# EAGLE design n64-rgb-dac (EAGLE 7.2.0)
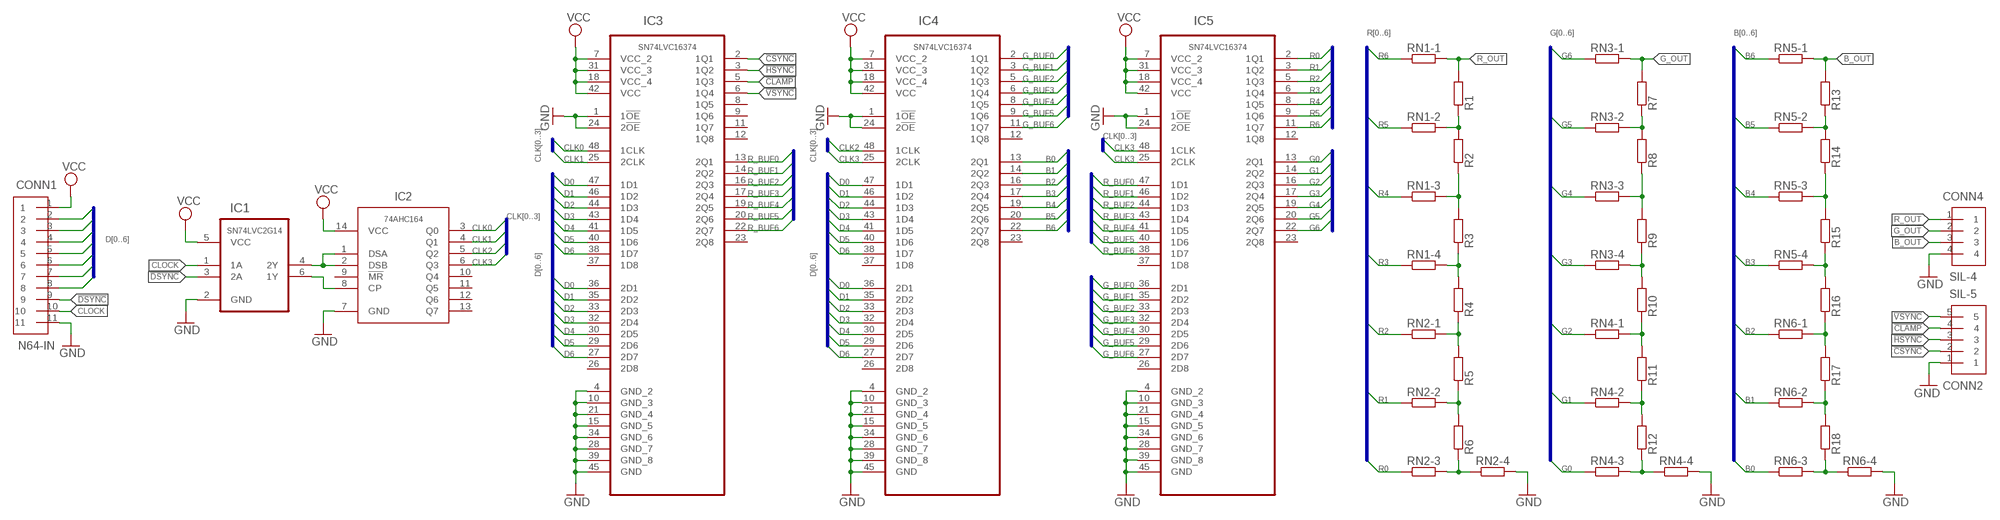
[diagram p0: schematic, sheet 1]

## Parts
CONN1  N64-IN  SIL-11  [SIL-SMD-11]
CONN2  SIL-5  [SIL-SMD-5]
CONN4  SIL-4  [SIL-SMD-4]
IC1  SN74LVC2G14  SN74LVC2G14IDCKRQ1  [SOT65P210X110-6N]
IC2  74AHC164PW  [SOT402-1]
IC3  SN74LVC16374DL  [SOP63P1035X279-48N]
IC4  SN74LVC16374DL  [SOP63P1035X279-48N]
IC5  SN74LVC16374DL  [SOP63P1035X279-48N]
R1  R-EU_R0603  [R0603]
R2  R-EU_R0603  [R0603]
R3  R-EU_R0603  [R0603]
R4  R-EU_R0603  [R0603]
R5  R-EU_R0603  [R0603]
R6  R-EU_R0603  [R0603]
R7  R-EU_R0603  [R0603]
R8  R-EU_R0603  [R0603]
R9  R-EU_R0603  [R0603]
R10  R-EU_R0603  [R0603]
R11  R-EU_R0603  [R0603]
R12  R-EU_R0603  [R0603]
R13  R-EU_R0603  [R0603]
R14  R-EU_R0603  [R0603]
R15  R-EU_R0603  [R0603]
R16  R-EU_R0603  [R0603]
R17  R-EU_R0603  [R0603]
R18  R-EU_R0603  [R0603]
RN1  TC164  [R0603_NET_4]
RN2  TC164  [R0603_NET_4]
RN3  TC164  [R0603_NET_4]
RN4  TC164  [R0603_NET_4]
RN5  TC164  [R0603_NET_4]
RN6  TC164  [R0603_NET_4]

## Nets
!CLAMP: CONN2.4 IC3.5(1Q3)
!CSYNC: CONN2.2 IC3.2(1Q1)
!DSYNC: CONN1.9 IC1.3(2A)
!HSYNC: CONN2.3 IC3.3(1Q2)
!VSYNC: CONN2.5 IC3.6(1Q4)
B0: IC4.13(2Q1) RN6.5
B1: IC4.14(2Q2) RN6.3
B2: IC4.16(2Q3) RN6.1
B3: IC4.17(2Q4) RN5.7
B4: IC4.19(2Q5) RN5.5
B5: IC4.20(2Q6) RN5.3
B6: IC4.22(2Q7) RN5.1
B_OUT: CONN4.3 R13.2 RN5.2
CLK0: IC2.3(Q0) IC3.48(1CLK)
CLK1: IC2.4(Q1) IC3.25(2CLK)
CLK2: IC2.5(Q2) IC4.48(1CLK)
CLK3: IC2.6(Q3) IC4.25(2CLK) IC5.25(2CLK) IC5.48(1CLK)
CLOCK: CONN1.10 IC1.1(1A)
D0: CONN1.2 IC3.36(2D1) IC3.47(1D1) IC4.36(2D1) IC4.47(1D1)
D1: CONN1.3 IC3.35(2D2) IC3.46(1D2) IC4.35(2D2) IC4.46(1D2)
D2: CONN1.4 IC3.33(2D3) IC3.44(1D3) IC4.33(2D3) IC4.44(1D3)
D3: CONN1.5 IC3.32(2D4) IC3.43(1D4) IC4.32(2D4) IC4.43(1D4)
D4: CONN1.6 IC3.30(2D5) IC3.41(1D5) IC4.30(2D5) IC4.41(1D5)
D5: CONN1.7 IC3.29(2D6) IC3.40(1D6) IC4.29(2D6) IC4.40(1D6)
D6: CONN1.8 IC3.27(2D7) IC3.38(1D7) IC4.27(2D7) IC4.38(1D7)
G0: IC5.13(2Q1) RN4.5
G1: IC5.14(2Q2) RN4.3
G2: IC5.16(2Q3) RN4.1
G3: IC5.17(2Q4) RN3.7
G4: IC5.19(2Q5) RN3.5
G5: IC5.20(2Q6) RN3.3
G6: IC5.22(2Q7) RN3.1
G_BUF0: IC4.2(1Q1) IC5.36(2D1)
G_BUF1: IC4.3(1Q2) IC5.35(2D2)
G_BUF2: IC4.5(1Q3) IC5.33(2D3)
G_BUF3: IC4.6(1Q4) IC5.32(2D4)
G_BUF4: IC4.8(1Q5) IC5.30(2D5)
G_BUF5: IC4.9(1Q6) IC5.29(2D6)
G_BUF6: IC4.11(1Q7) IC5.27(2D7)
G_OUT: CONN4.2 R7.2 RN3.2
GND: CONN1.11 CONN2.1 CONN4.4 IC1.2(GND) IC2.7(GND) IC3.1(1!OE) IC3.4(GND_2) IC3.10(GND_3) IC3.15(GND_5) IC3.21(GND_4) IC3.24(2!OE) IC3.28(GND_7) IC3.34(GND_6) IC3.39(GND_8) IC3.45(GND) IC4.1(1!OE) IC4.4(GND_2) IC4.10(GND_3) IC4.15(GND_5) IC4.21(GND_4) IC4.24(2!OE) IC4.28(GND_7) IC4.34(GND_6) IC4.39(GND_8) IC4.45(GND) IC5.1(1!OE) IC5.4(GND_2) IC5.10(GND_3) IC5.15(GND_5) IC5.21(GND_4) IC5.24(2!OE) IC5.28(GND_7) IC5.34(GND_6) IC5.39(GND_8) IC5.45(GND) RN2.8 RN4.8 RN6.8
N$1: IC1.4(2Y) IC2.1(DSA) IC2.2(DSB)
N$2: IC1.6(1Y) IC2.8(CP)
N$4: R1.1 R2.2 RN1.4
N$5: R2.1 R3.2 RN1.6
N$6: R3.1 R4.2 RN1.8
N$7: R6.1 RN2.6 RN2.7
N$8: R7.1 R8.2 RN3.4
N$9: R5.1 R6.2 RN2.4
N$10: R4.1 R5.2 RN2.2
N$12: R8.1 R9.2 RN3.6
N$13: R9.1 R10.2 RN3.8
N$14: R12.1 RN4.6 RN4.7
N$15: R11.1 R12.2 RN4.4
N$16: R10.1 R11.2 RN4.2
N$17: R13.1 R14.2 RN5.4
N$19: R14.1 R15.2 RN5.6
N$20: R15.1 R16.2 RN5.8
N$21: R18.1 RN6.6 RN6.7
N$22: R17.1 R18.2 RN6.4
N$23: R16.1 R17.2 RN6.2
R0: IC5.2(1Q1) RN2.5
R1: IC5.3(1Q2) RN2.3
R2: IC5.5(1Q3) RN2.1
R3: IC5.6(1Q4) RN1.7
R4: IC5.8(1Q5) RN1.5
R5: IC5.9(1Q6) RN1.3
R6: IC5.11(1Q7) RN1.1
R_BUF0: IC3.13(2Q1) IC5.47(1D1)
R_BUF1: IC3.14(2Q2) IC5.46(1D2)
R_BUF2: IC3.16(2Q3) IC5.44(1D3)
R_BUF3: IC3.17(2Q4) IC5.43(1D4)
R_BUF4: IC3.19(2Q5) IC5.41(1D5)
R_BUF5: IC3.20(2Q6) IC5.40(1D6)
R_BUF6: IC3.22(2Q7) IC5.38(1D7)
R_OUT: CONN4.1 R1.2 RN1.2
VCC: CONN1.1 IC1.5(VCC) IC2.14(VCC) IC3.7(VCC_2) IC3.18(VCC_4) IC3.31(VCC_3) IC3.42(VCC) IC4.7(VCC_2) IC4.18(VCC_4) IC4.31(VCC_3) IC4.42(VCC) IC5.7(VCC_2) IC5.18(VCC_4) IC5.31(VCC_3) IC5.42(VCC)
Unconnected: IC2.9(!MR) IC2.10(Q4) IC2.11(Q5) IC2.12(Q6) IC2.13(Q7) IC3.8(1Q5) IC3.9(1Q6) IC3.11(1Q7) IC3.12(1Q8) IC3.23(2Q8) IC3.26(2D8) IC3.37(1D8) IC4.12(1Q8) IC4.23(2Q8) IC4.26(2D8) IC4.37(1D8) IC5.12(1Q8) IC5.23(2Q8) IC5.26(2D8) IC5.37(1D8)

## Buses
D[0..6]
CLK[0..3]
B[0..6]
R[0..6]
G[0..6]
R_BUF[0..6]
G_BUF[0..6]

## Library data of the parts
CONN1 = n64-rgb-dac:SIL-11
CONN2 = n64-rgb-dac:SIL-5
CONN4 = n64-rgb-dac:SIL-4
IC1 = n64-rgb-dac:SN74LVC2G14IDCKRQ1: DUAL SCHMITT-TRIGGER INVERTER; MPN: SN74LVC2G14IDCKRQ1; OC_FARNELL: 1236370; OC_NEWARK: 13M2924; PACKAGE: SC70-6; SUPPLIER: Texas Instruments
IC2 = n64-rgb-dac:74AHC164
IC3-IC5 = n64-rgb-dac:SN74LVC16374DL: 16-BIT EDGE-TRIGGERED D-TYPE FLIP-FLOPS; MPN: SN74LVC16374DL; OC_FARNELL: 1739889; OC_NEWARK: 50R6626; PACKAGE: 48-SSOP; SUPPLIER: Texas Instruments
R1-R18 = rcl:R-EU_: RESISTOR, European symbol
RN1-RN6 = n64-rgb-dac:TC164

## Board
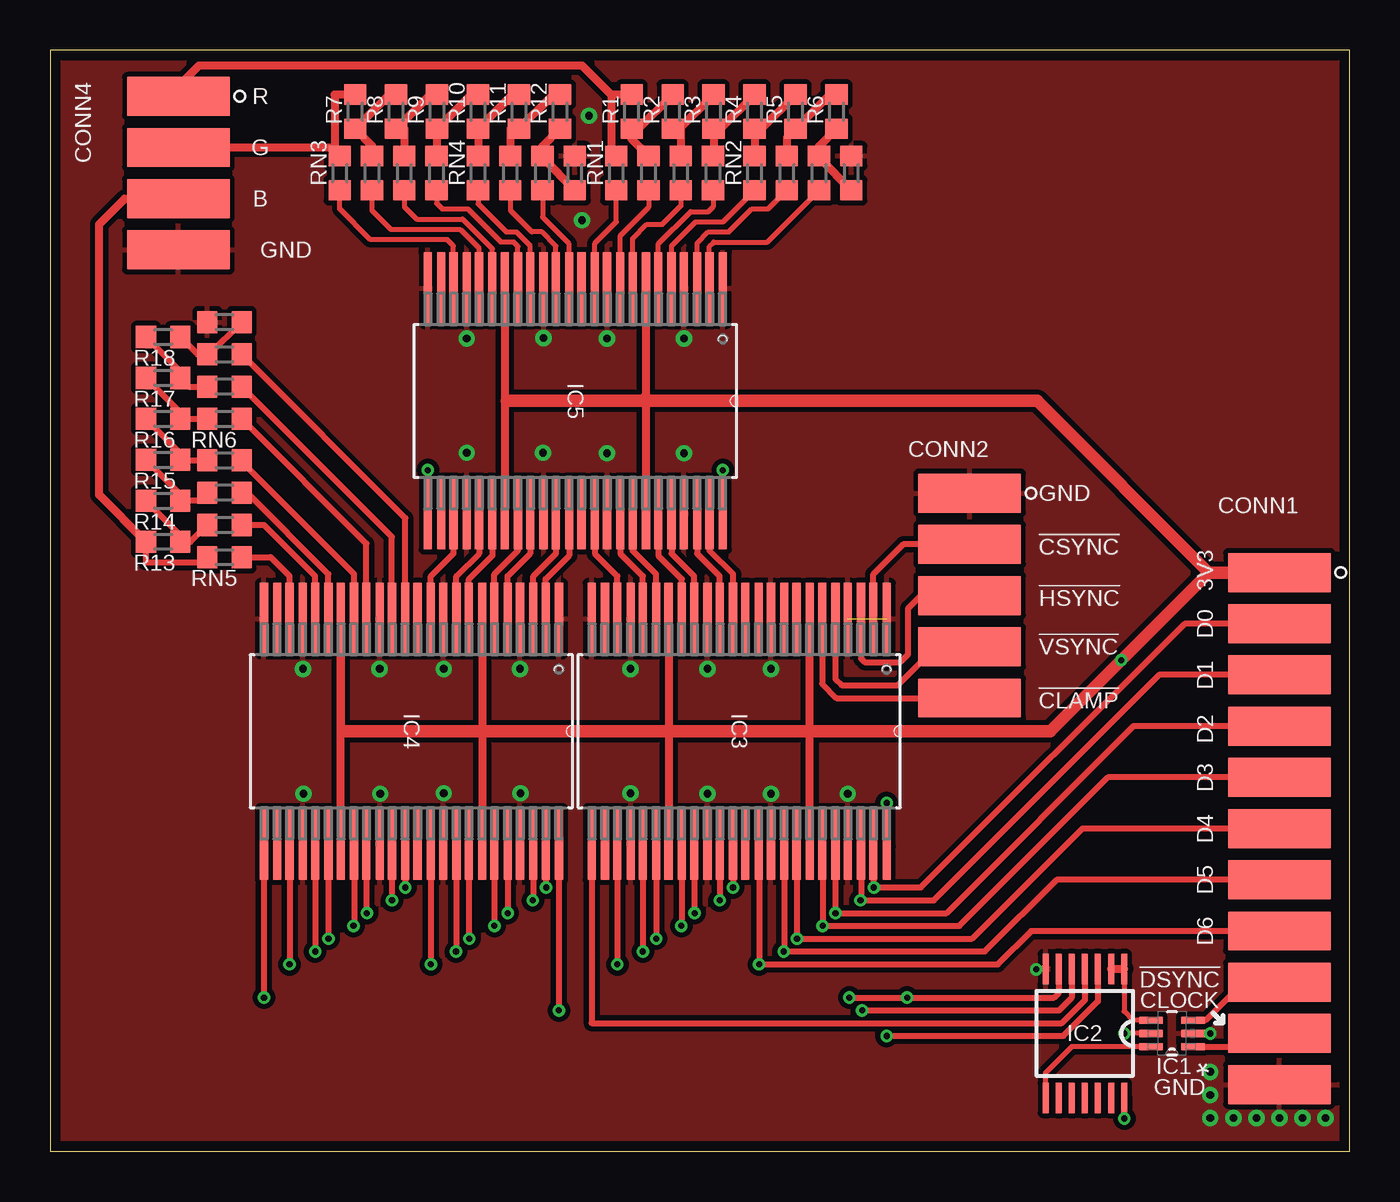
[diagram p1: board, top side]
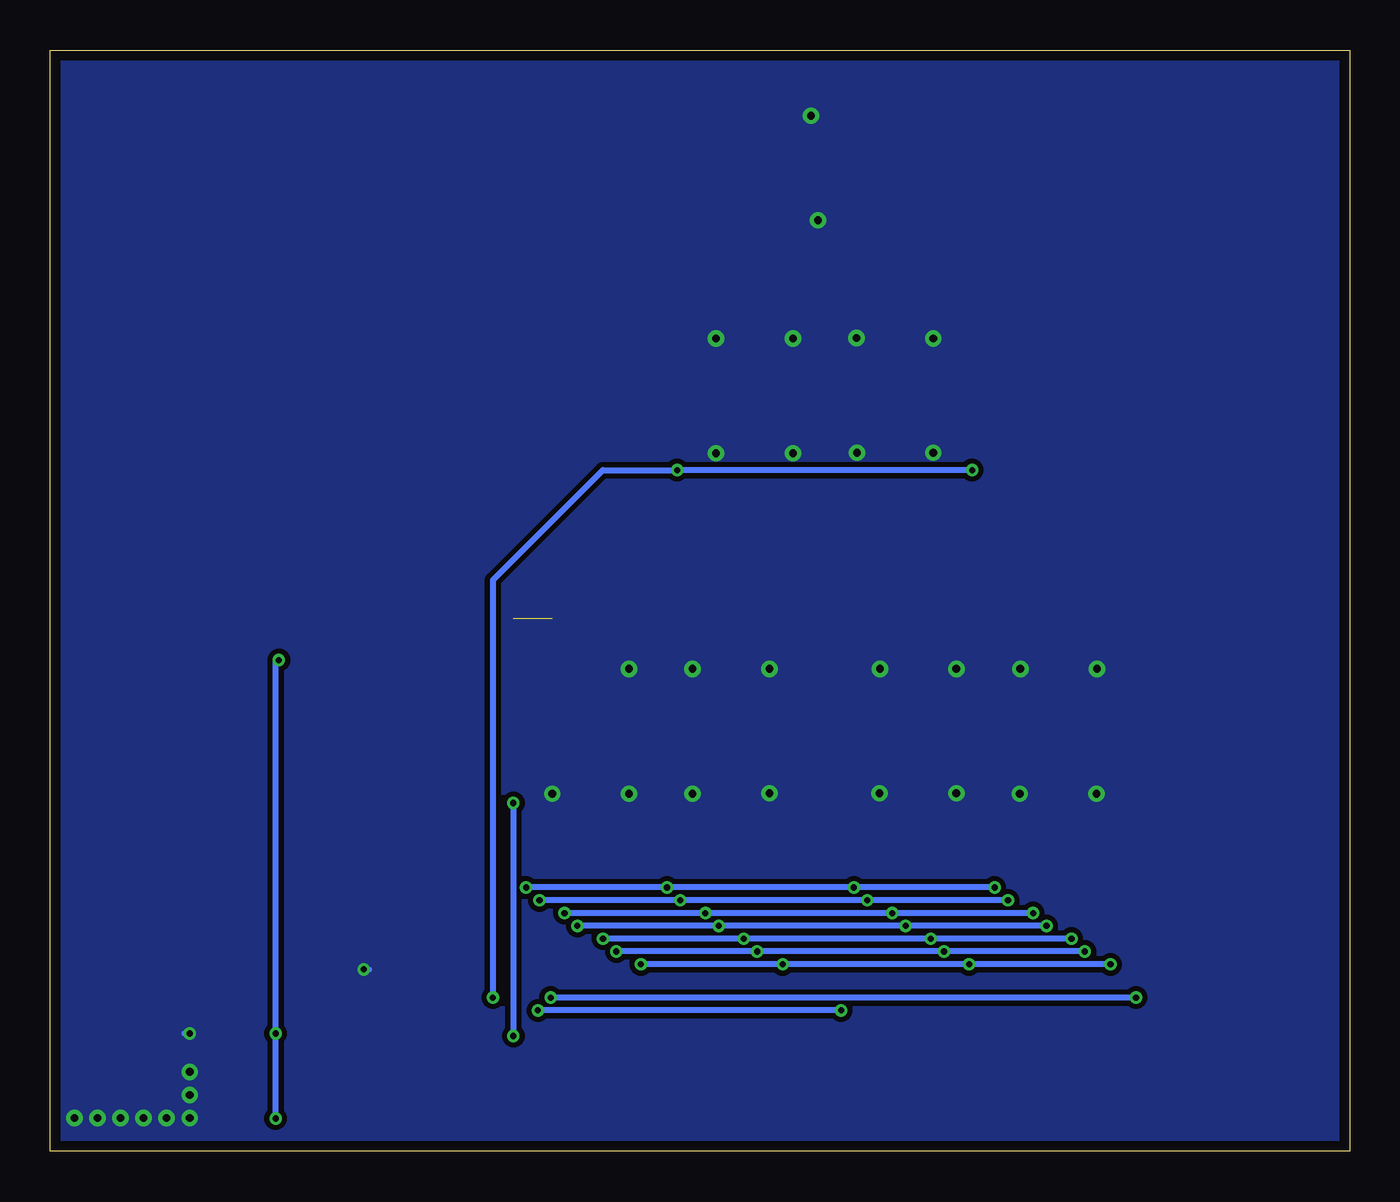
[diagram p2: board, bottom side, seen from below]

Size 64.44 x 54.6 mm. Coordinates in mm from the lower left corner, seen from the top.
Outline: 0,0 64.44,0 64.44,54.6 0,54.6 0,0
Copper layers (1*16): Top 0.035mm / dielectric 1.5mm / Bottom 0.035mm
Design rules "EagleRules": minimum track width 7mil, minimum drill 12mil, track to track 7mil, track to pad 7mil, pad to pad 7mil, via to via 7mil, smd to smd 0mil, copper to edge 20mil, drill to drill 10mil, minimum pad ring 10mil, minimum via ring 6mil, stop-mask expansion 2mil, vias tented up to drill 25mil, thermal gap 10mil

### Footprints (pad centres in the part's own frame; a part is rotated, then mirrored left to right if it is on the bottom)
SIL-SMD-11 = smd 5.08 x 1.93: 1 0,12.7; 2 0,10.16; 3 0,7.62; 4 0,5.08; 5 0,2.54; 6 0,0; 7 0,-2.54; 8 0,-5.08; 9 0,-7.62; 10 0,-10.16; 11 0,-12.7
SIL-SMD-5 = smd 5.08 x 1.93: 1 0,5.08; 2 0,2.54; 3 0,0; 4 0,-2.54; 5 0,-5.08
SIL-SMD-4 = smd 5.08 x 1.93: 1 0,3.81; 2 0,1.27; 3 0,-1.27; 4 0,-3.81
SOT65P210X110-6N = smd 1.168 x 0.356: 1 -1.041,0.66; 2 -1.041,0; 3 -1.041,-0.66; 4 1.041,-0.66; 5 1.041,0; 6 1.041,0.66
SOT402-1 = smd 1.5 x 0.3: 1 -3.2,1.95; 2 -3.2,1.3; 3 -3.2,0.65; 4 -3.2,0; 5 -3.2,-0.65; 6 -3.2,-1.3; 7 -3.2,-1.95; 8 3.2,-1.95; 9 3.2,-1.3; 10 3.2,-0.65; 11 3.2,0; 12 3.2,0.65; 13 3.2,1.3; 14 3.2,1.95
SOP63P1035X279-48N = smd 3.556 x 0.406: 1 -5.588,7.315; 2 -5.588,6.655; 3 -5.588,6.045; 4 -5.588,5.385; 5 -5.588,4.775; 6 -5.588,4.115; 7 -5.588,3.505; 8 -5.588,2.845; 9 -5.588,2.235; 10 -5.588,1.575; 11 -5.588,0.965; 12 -5.588,0.305; 13 -5.588,-0.305; 14 -5.588,-0.965; 15 -5.588,-1.575; 16 -5.588,-2.235; 17 -5.588,-2.845; 18 -5.588,-3.505; 19 -5.588,-4.115; 20 -5.588,-4.775; 21 -5.588,-5.385; 22 -5.588,-6.045; 23 -5.588,-6.655; 24 -5.588,-7.315; 25 5.588,-7.315; 26 5.588,-6.655; 27 5.588,-6.045; 28 5.588,-5.385; 29 5.588,-4.775; 30 5.588,-4.115; 31 5.588,-3.505; 32 5.588,-2.845; 33 5.588,-2.235; 34 5.588,-1.575; 35 5.588,-0.965; 36 5.588,-0.305; 37 5.588,0.305; 38 5.588,0.965; 39 5.588,1.575; 40 5.588,2.235; 41 5.588,2.845; 42 5.588,3.505; 43 5.588,4.115; 44 5.588,4.775; 45 5.588,5.385; 46 5.588,6.045; 47 5.588,6.655; 48 5.588,7.315
R0603 = smd 1 x 1.1: 1 -0.85,0; 2 0.85,0
R0603_NET_4 = smd 1 x 1.1: 1 -0.85,0; 2 0.85,0; 3 -0.85,-1.6; 4 0.85,-1.6; 5 -0.85,-3.2; 6 0.85,-3.2; 7 -0.85,-4.8; 8 0.85,-4.8

### Placement (x,y rotation side)
CONN1  60.96,16 0 top
CONN2  45.59,27.56 0 top
CONN4  6.35,48.51 0 top
IC1  55.63,5.84 180 top
IC2  51.31,5.84 270 top
IC3  34.16,20.83 270 top
IC4  17.91,20.83 270 top
IC5  26.04,37.21 270 top
R1  28.83,51.56 90 top
R2  30.86,51.56 90 top
R3  32.89,51.56 90 top
R4  34.92,51.56 90 top
R5  36.96,51.56 90 top
R6  38.99,51.56 90 top
R7  15.11,51.56 90 top
R8  17.14,51.56 90 top
R9  19.18,51.56 90 top
R10  21.21,51.56 90 top
R11  23.24,51.56 90 top
R12  25.27,51.56 90 top
R13  5.59,30.23 180 top
R14  5.59,32.26 180 top
R15  5.59,34.29 180 top
R16  5.59,36.32 180 top
R17  5.59,38.35 180 top
R18  5.59,40.39 180 top
RN1  28.07,48.51 90 top
RN2  34.92,48.51 90 top
RN3  14.35,48.51 90 top
RN4  21.21,48.51 90 top
RN5  8.64,29.46 180 top
RN6  8.64,36.32 180 top

### Tracks (layer width: path | path; a pad name or v marks a point on that pad's centre or on a via)
!CLAMP
  Top 0.305: IC3.5 38.94,23.42 39.24,23.11 42.04,23.11 43.94,25.02 CONN2.4 45.72,25.15 46.1,25.15 46.23,25.02
!CSYNC
  Top 0.305: IC3.2 40.82,28.63 42.29,30.1 CONN2.2
!DSYNC
  Top 0.305: IC1.3 57.3,6.5 59.18,8.38 CONN1.9
!HSYNC
  Top 0.305: IC3.3 40.21,24.43 40.39,24.26 42.16,24.26 42.55,24.64 42.55,26.92 43.18,27.56 CONN2.3
!VSYNC
  Top 0.305: IC3.6 38.28,23.19 38.99,22.48 CONN2.5
B0
  Top 0.305: IC4.13 17.6,31.41 RN6.5
B1
  Top 0.305: IC4.14 16.94,30.47 RN6.3
B2
  Top 0.305: IC4.16 15.67,30.14 RN6.1
B3
  Top 0.305: IC4.17 15.06,28.63 9.49,34.2 RN5.7
B4
  Top 0.305: IC4.19 13.79,28.63 9.75,32.66 RN5.5
B5
  Top 0.305: IC4.20 13.13,28.52 10.59,31.06 RN5.3
B6
  Top 0.305: IC4.22 11.86,28.52 10.92,29.46 RN5.1
B_OUT
  Top 0.305: R13.2 4.74,29.21 7.53,29.21 RN5.2
  Top 0.406: R13.2 2.41,32.55 2.41,45.97 3.68,47.24 CONN4.3
CLK0  (via drill 0.3 pad 0.61)
  Top 0.305: IC2.3 51.96,7.43 50.24,5.71 v41.48,5.71 | 41.48,15.11 41.53,15.11 41.48,15.16 IC3.48 v41.48,17.27
  Bottom 0.305: v41.48,17.27 v41.48,5.71
CLK1
  Top 0.305: IC2.4 51.31,7.49 50.16,6.35 26.85,6.35 IC3.25
CLK2  (via drill 0.3 pad 0.61)
  Top 0.305: IC2.5 50.66,7.61 50.04,6.99 v40.26,6.99 | IC4.48 v25.22,6.99
  Bottom 0.305: v25.22,6.99 v40.26,6.99
CLK3  (via drill 0.3 pad 0.61)
  Top 0.305: IC2.6 50.01,7.84 49.78,7.62 v42.49,7.62 v39.62,7.62 | IC4.25 v10.59,7.62 | IC5.48 v33.35,33.78 | IC5.25 v18.72,33.78
  Bottom 0.305: v10.59,7.62 v39.62,7.62 | v18.72,33.78 v33.35,33.78 37.03,33.78 42.49,28.32 v42.49,7.62
CLOCK
  Top 0.305: IC1.1 60.3,5.18 CONN1.10
D0  (via drill 0.3 pad 0.61)
  Top 0.305: IC3.36 v33.86,13.08 | IC4.36 v17.6,13.08 | CONN1.2 56.26,26.16 43.18,13.08 v40.84,13.08 40.82,13.11 IC3.47 | IC4.47 24.56,13.11 v24.59,13.08
  Bottom 0.305: v40.84,13.08 v33.86,13.08 v24.59,13.08 v17.6,13.08
D1  (via drill 0.3 pad 0.61)
  Top 0.305: IC3.35 v33.2,12.45 | IC4.35 v16.94,12.45 | CONN1.3 54.99,23.62 43.81,12.45 v40.18,12.45 40.21,12.47 IC3.46 | IC4.46 23.95,12.47 v23.93,12.45
  Bottom 0.305: v40.18,12.45 v33.2,12.45 v23.93,12.45 v16.94,12.45
D2  (via drill 0.3 pad 0.61)
  Top 0.254: IC3.44 38.96,15.21
  Top 0.305: IC3.44 v38.94,11.81 44.45,11.81 53.72,21.08 CONN1.4 | IC4.44 v22.68,11.81 | IC4.33 15.67,11.84 v15.7,11.81 | IC3.33 31.93,11.84 v31.95,11.81
  Bottom 0.305: v38.94,11.81 v31.95,11.81 v22.68,11.81 v15.7,11.81
D3  (via drill 0.3 pad 0.61)
  Top 0.254: IC3.43 38.3,15.21
  Top 0.305: 38.3,15.21 v38.3,11.18 45.09,11.18 52.45,18.54 CONN1.5 | IC4.43 v22.02,11.18 | IC4.32 15.06,11.2 v15.04,11.18 | IC3.32 31.32,11.2 v31.29,11.18
  Bottom 0.305: v38.3,11.18 v31.29,11.18 v22.02,11.18 v15.04,11.18
D4  (via drill 0.3 pad 0.61)
  Top 0.305: IC3.30 v30.05,10.54 | IC4.30 v13.79,10.54 | CONN1.6 51.18,16 45.72,10.54 v37.03,10.54 37.01,10.57 IC3.41 | IC4.41 20.75,10.57 v20.78,10.54
  Bottom 0.305: v37.03,10.54 v30.05,10.54 v20.78,10.54 v13.79,10.54
D5  (via drill 0.3 pad 0.61)
  Top 0.305: IC3.29 v29.39,9.91 | IC4.29 v13.13,9.91 | CONN1.7 49.91,13.46 46.35,9.91 v36.37,9.91 36.4,9.93 IC3.40 | IC4.40 20.14,9.93 v20.12,9.91
  Bottom 0.305: v36.37,9.91 v29.39,9.91 v20.12,9.91 v13.13,9.91
D6  (via drill 0.3 pad 0.61)
  Top 0.254: IC3.38 35.15,15.21
  Top 0.305: 35.15,15.21 v35.15,9.27 46.99,9.27 48.64,10.92 CONN1.8 | IC3.27 v28.12,9.27 | IC4.38 v18.87,9.27 | IC4.27 v11.86,9.27
  Bottom 0.305: v35.15,9.27 v28.12,9.27 v18.87,9.27 v11.86,9.27
G0
  Top 0.254: IC5.13 25.73,45.01 24.41,46.33 RN4.5
G1
  Top 0.254: RN4.3 22.81,46.66 23.88,45.59 24.38,45.59 25.07,44.91 IC5.14
G2
  Top 0.254: RN4.1 21.21,46.99 22.61,45.59 23.11,45.59 23.8,44.91 IC5.16
G3
  Top 0.254: RN3.7 19.15,47.02 19.43,46.74 20.7,46.74 22.35,45.09 22.99,45.09 23.19,44.88 IC5.17
G4
  Top 0.254: RN3.5 17.55,46.84 18.16,46.23 20.45,46.23 21.92,44.76 IC5.19
G5
  Top 0.254: RN3.3 15.95,46.66 16.89,45.72 20.32,45.72 21.26,44.78 IC5.20
G6
  Top 0.254: IC5.22 19.99,44.91 19.68,45.21 15.88,45.21 14.35,46.74 RN3.1
G_BUF0
  Top 0.305: IC5.36 25.73,29.54 24.56,28.37 IC4.2
G_BUF1
  Top 0.305: IC5.35 25.07,29.64 23.95,28.52 IC4.3
G_BUF2
  Top 0.305: IC5.33 23.8,29.64 22.68,28.52 IC4.5
G_BUF3
  Top 0.305: IC5.32 23.19,29.79 22.02,28.63 IC4.6
G_BUF4
  Top 0.305: IC5.30 21.92,29.54 20.75,28.37 IC4.8
G_BUF5
  Top 0.305: IC5.29 21.26,29.64 20.14,28.52 IC4.9
G_BUF6
  Top 0.305: IC5.27 19.99,29.64 18.87,28.52 IC4.11
G_OUT
  Top 0.406: R7.2 14.1,52.41 14.1,49.62 | 14.1,49.62 RN3.2 | 14.1,49.62 13.93,49.78 CONN4.2
GND  (via drill 0.3 pad 0.61, 0.38 pad 0.81)  (1 unrouted)
  Top 0.305: IC1.2 v57.53,5.84 | IC2.7 48.9,9.04 v48.9,9.02
  Bottom 0.305: v57.53,5.84 57.78,5.84 | v48.9,9.02 48.64,9.02
  other vias: 57.53,3.94 60.96,1.65 35.74,23.93 32.59,23.93 35.74,17.73 32.59,17.73 57.53,2.79 57.53,1.65 58.67,1.65 59.82,1.65 62.1,1.65 63.25,1.65 23.29,23.93 19.51,23.93 16.33,23.93 16.36,17.73 19.51,17.75 28.78,23.93 39.55,17.73 23.32,17.75 28.78,17.75 12.52,23.93 12.55,17.73 24.43,34.65 27.61,34.62 31.42,34.62 20.65,34.65 24.46,40.34 27.61,40.31 31.42,40.31 20.65,40.31 26.72,51.36 26.37,46.18
  pour Bottom (isolate 0.254): 0,54.61 64.52,54.61 64.52,0 0,0
  pour Top (isolate 0.254): 0,54.61 64.52,54.61 64.52,0 0,0
N$1
  Top 0.254: IC2.1 53.26,6.94 53.7,6.5 IC1.4
  Top 0.406: IC2.2 IC2.1
N$2
  Top 0.254: IC1.6 50.65,5.18 49.36,3.89 IC2.8
N$4
  Top 0.406: RN1.4 28.83,50.2 R1.1 29.16,50.71 R2.2
N$5
  Top 0.406: R3.2 31.19,50.71 R2.1 31.27,50.71 RN1.6
N$6
  Top 0.406: RN1.8 32.89,49.39 R3.1 33.23,50.71 R4.2
N$7
  Top 0.406: R6.1 38.12,49.85 RN2.6 38.12,49.26 RN2.7
N$8
  Top 0.406: RN3.4 15.95,49.87 R7.1 16.81,52.41 R8.2
N$9
  Top 0.406: RN2.4 36.52,50.28 R5.1 38.66,52.41 R6.2
N$10
  Top 0.406: RN2.2 R4.1 35.26,50.71 R5.2
N$12
  Top 0.406: R9.2 18.84,52.41 R8.1 17.55,50.71 RN3.6
N$13
  Top 0.406: R10.2 20.88,52.41 R9.1 19.15,50.71 RN3.8
N$14
  Top 0.406: R12.1 24.41,49.85 RN4.6 24.41,49.26 RN4.7
N$15
  Top 0.406: R12.2 24.94,52.41 R11.1 22.81,50.71 RN4.4
N$16
  Top 0.406: R11.2 22.91,52.41 R10.1 RN4.2
N$17
  Top 0.305: R14.2 6.44,30.56 R13.1 6.95,30.23 RN5.4
N$19
  Top 0.305: R15.2 6.44,32.59 R14.1 7.38,32.26 RN5.6
N$20
  Top 0.305: R16.2 6.44,34.62 R15.1 6.46,34.26 RN5.8
N$21
  Top 0.305: RN6.7 7.89,39.52 RN6.6 7.3,39.52 R18.1
N$22
  Top 0.305: R18.2 6.44,38.69 R17.1 6.87,37.92 RN6.4
N$23
  Top 0.305: R17.2 6.44,36.65 R16.1 RN6.2
R0
  Top 0.254: IC5.2 32.69,44.88 32.89,45.09 35.55,45.09 RN2.5
R1
  Top 0.254: IC5.3 32.08,45.03 32.64,45.59 33.66,45.59 34.8,46.74 35.6,46.74 RN2.3
R2
  Top 0.254: IC5.5 30.81,44.91 32,46.1 33.36,46.1 RN2.1
R3
  Top 0.254: IC5.6 30.15,45.01 31.75,46.61 32.64,46.61 32.87,46.84 RN1.7
R4
  Top 0.254: IC5.8 28.88,45.26 29.59,45.97 30.35,45.97 31.27,46.89 RN1.5
R5
  Top 0.254: IC5.9 28.27,45.41 29.67,46.81 RN1.3
R6
  Top 0.254: IC5.11 27,45.03 28.07,46.1 RN1.1
R_BUF0
  Top 0.305: IC5.47 32.69,29.79 33.86,28.63 IC3.13
R_BUF1
  Top 0.305: IC5.46 32.08,29.64 33.2,28.52 IC3.14
R_BUF2
  Top 0.305: IC5.44 30.81,29.64 31.93,28.52 IC3.16
R_BUF3
  Top 0.305: IC5.43 30.15,29.54 31.32,28.37 IC3.17
R_BUF4
  Top 0.305: IC5.41 28.88,29.79 30.05,28.63 IC3.19
R_BUF5
  Top 0.305: IC5.40 28.27,29.64 29.39,28.52 IC3.20
R_BUF6
  Top 0.305: IC5.38 27,29.64 28.12,28.52 IC3.22
R_OUT
  Top 0.406: R1.2 27.81,52.41 | 27.81,52.41 27.81,49.62 RN1.2 | 27.81,52.41 26.38,53.85 7.37,53.85 6.35,52.83 CONN4.1
VCC  (via drill 0.3 pad 0.3, 0.3 pad 0.61)
  Top 0.254: IC1.5 v53.26,5.84
  Top 0.305: IC2.14 v53.26,1.63
  Top 0.406: IC3.7 IC3.42 37.67,20.83 37.72,20.83 | IC3.31 IC3.18 30.66,20.83 | IC4.31 14.4,20.75 | 14.4,20.75 IC4.18 14.4,20.83 | IC4.42 21.41,20.83 IC4.7 | 14.63,20.83 14.63,20.75 14.4,20.75 | IC5.7 29.54,37.34 29.54,37.21 IC5.42 | IC5.18 22.53,37.21 | 22.53,37.21 IC5.31 | 22.66,37.21 22.53,37.21
  Top 0.61: 14.63,20.83 21.41,20.83 30.66,20.83 37.72,20.83 49.58,20.83 v53.11,24.36 57.45,28.7 | CONN1.1 57.45,28.7 | 22.66,37.21 29.54,37.21 48.95,37.21 57.45,28.7 | 30.86,37.21 29.67,37.21 29.54,37.34
  Bottom 0.305: v53.26,1.63 v53.26,5.84 53.26,24.21 v53.11,24.36

### Text on the board
tNames: R | G | B | GND | GND | !CSYNC | 3V3 | !HSYNC | D0 | !VSYNC | D1 | !CLAMP | D2 | D3 | D4 | D5 | D6 | !DSYNC | CLOCK | GND